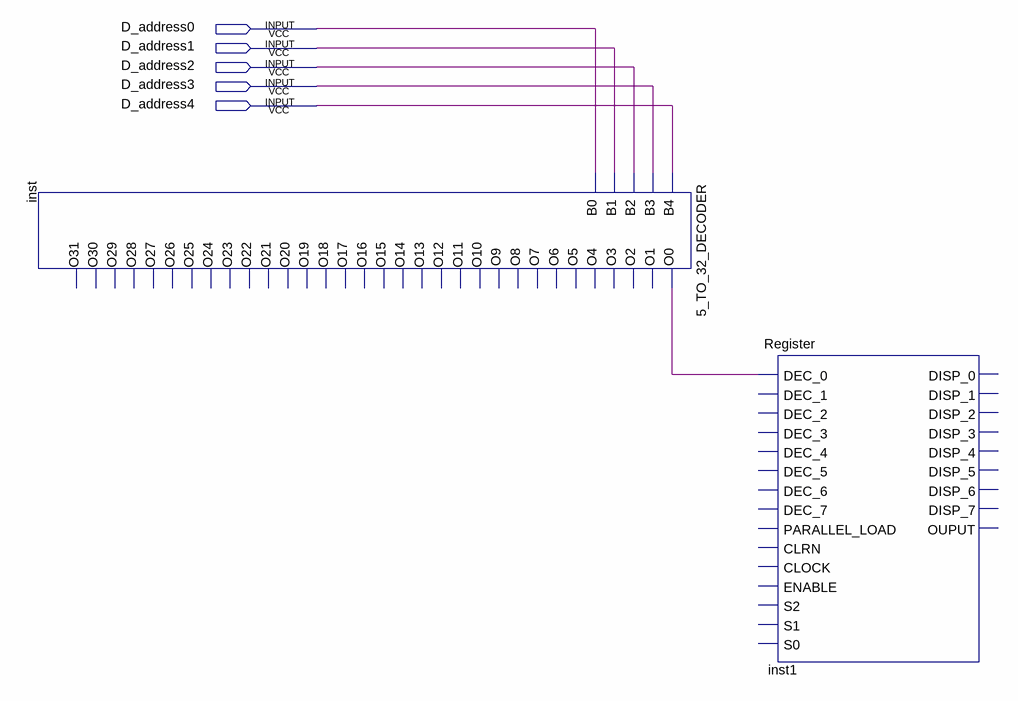
[diagram p0: schematic sheet]
// Quartus schematic WMIPAVR.bdf as structural Verilog: 2 symbols, 5 pins
module WMIPAVR (
  input  D_address0,
  input  D_address1,
  input  D_address2,
  input  D_address3,
  input  D_address4
);

  wire inst_o0;

  \5_TO_32_DECODER  inst (
    .B4(D_address4), .B3(D_address3), .B2(D_address2), .B1(D_address1), .B0(D_address0), .O0(inst_o0));  // open: O1, O2, O3, O4, O5, O6, O7, O8, O9, O10, O11, O12, O13, O14, O15, O16, O17, O18, O19, O20, O21, O22, O23, O24, O25, O26, O27, O28, O29, O30, O31
  Register inst1 (.DEC_0(inst_o0));  // open: DEC_1, DEC_2, DEC_3, DEC_4, DEC_5, DEC_6, DEC_7, PARALLEL_LOAD, CLRN, CLOCK, ENABLE, S2, S1, S0, DISP_0, DISP_1, DISP_2, DISP_3, DISP_4, DISP_5, DISP_6, DISP_7, OUPUT
endmodule
